# Altium schematic sheet mainboard.SchDoc
size A; SheetNumber: 1; SheetTotal: 8
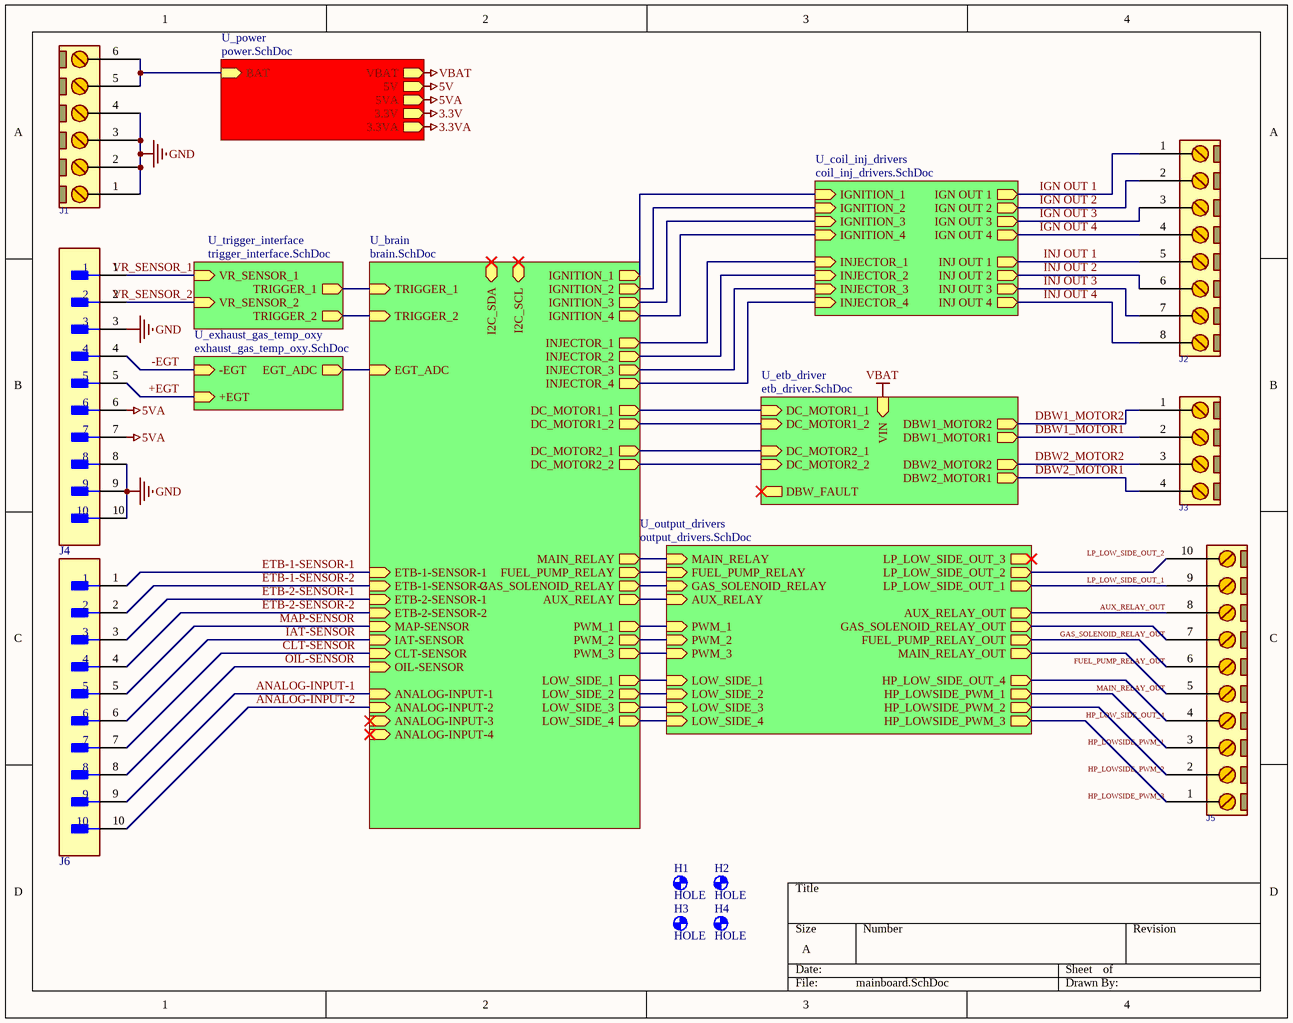
[diagram p0: mainboard.SchDoc]

## Parts
H1  HOLE  [P3.2]  (no BOM)
H2  HOLE  [P3.2]  (no BOM)
H3  HOLE  [P3.2]  (no BOM)
H4  HOLE  [P3.2]  (no BOM)
J1  CONN_TB6  [MSTB_6]  (value not drawn)
J2  CONN_TB8  [MSTB_8]  (value not drawn)
J3  CONN_TB4  [MSTB_4]  (value not drawn)
J4  PHOENIX MINI 10P  [CON_PHOENIX_MINI_10]  (value not drawn)
J5  CONN_TB10  [MSTB_10]  (value not drawn)
J6  PHOENIX MINI 10P  [CON_PHOENIX_MINI_10]  (value not drawn)

## Sub-sheets
U_brain = brain.SchDoc: LOW_SIDE_1 (out), INJECTOR_3 (out), INJECTOR_2 (out), INJECTOR_1 (out), I2C_SCL (bidir), I2C_SDA (bidir), TRIGGER_1 (in), MAIN_RELAY (out), FUEL_PUMP_RELAY (out), AUX_RELAY (out), DC_MOTOR1_2 (out), DC_MOTOR1_1 (out), IGNITION_1 (out), ETB-1-SENSOR-1 (in), ETB-1-SENSOR-2 (in), ETB-2-SENSOR-1 (in), ETB-2-SENSOR-2 (in), INJECTOR_4 (out), IGNITION_2 (out), IGNITION_3 (out), IGNITION_4 (out), DC_MOTOR2_2 (out), DC_MOTOR2_1 (out), LOW_SIDE_2 (out), LOW_SIDE_3 (out), LOW_SIDE_4 (out), TRIGGER_2 (in), MAP-SENSOR (in), IAT-SENSOR (in), CLT-SENSOR (in), OIL-SENSOR (in), ANALOG-INPUT-1 (in), ANALOG-INPUT-3 (in), ANALOG-INPUT-4 (in), ANALOG-INPUT-2 (in), PWM_1 (out), PWM_2 (out), PWM_3 (out), EGT_ADC (in), GAS_SOLENOID_RELAY (out)
U_coil_inj_drivers = coil_inj_drivers.SchDoc: IGN OUT 1 (out), IGN OUT 2 (out), IGN OUT 3 (out), IGN OUT 4 (out), INJ OUT 4 (out), INJ OUT 3 (out), INJ OUT 2 (out), INJ OUT 1 (out), IGNITION_2 (in), IGNITION_3 (in), IGNITION_4 (in), INJECTOR_1 (in), INJECTOR_2 (in), INJECTOR_3 (in), INJECTOR_4 (in), IGNITION_1 (in)
U_etb_driver = etb_driver.SchDoc: VIN (in), DBW1_MOTOR1 (out), DBW1_MOTOR2 (out), DBW2_MOTOR1 (out), DBW2_MOTOR2 (out), DBW_FAULT (out), DC_MOTOR1_1 (in), DC_MOTOR1_2 (in), DC_MOTOR2_1 (in), DC_MOTOR2_2 (in)
U_exhaust_gas_temp_oxy = exhaust_gas_temp_oxy.SchDoc: -EGT (in), +EGT (in), EGT_ADC (out)
U_output_drivers = output_drivers.SchDoc: MAIN_RELAY_OUT (out), FUEL_PUMP_RELAY_OUT (out), GAS_SOLENOID_RELAY_OUT (out), AUX_RELAY (in), PWM_1 (in), PWM_2 (in), PWM_3 (in), LOW_SIDE_1 (in), LOW_SIDE_2 (in), LOW_SIDE_3 (in), LOW_SIDE_4 (in), HP_LOWSIDE_PWM_1 (out), HP_LOWSIDE_PWM_2 (out), HP_LOWSIDE_PWM_3 (out), AUX_RELAY_OUT (out), HP_LOW_SIDE_OUT_4 (out), LP_LOW_SIDE_OUT_1 (out), LP_LOW_SIDE_OUT_2 (out), LP_LOW_SIDE_OUT_3 (out), MAIN_RELAY (in), FUEL_PUMP_RELAY (in), GAS_SOLENOID_RELAY (in)
U_power = power.SchDoc: BAT (in), VBAT (out), 5V (out), 5VA (out), 3.3V (out), 3.3VA (out)
U_trigger_interface = trigger_interface.SchDoc: VR_SENSOR_1 (in), VR_SENSOR_2 (in), TRIGGER_2 (out), TRIGGER_1 (out)

## Nets
3.3V: sheet U_power/3.3V
3.3VA: sheet U_power/3.3VA
5V: sheet U_power/5V
5VA: J4.6 J4.7 ; sheet U_power/5VA
GND: J1.1 J1.2 J1.3 J1.4 J4.3 J4.8 J4.9 J4.10
VBAT: sheet U_etb_driver/VIN, sheet U_power/VBAT
+EGT: J4.5 ; sheet U_exhaust_gas_temp_oxy/+EGT
-EGT: J4.4 ; sheet U_exhaust_gas_temp_oxy/-EGT
ANALOG-INPUT-1: J6.9 ; sheet U_brain/ANALOG-INPUT-1
ANALOG-INPUT-2: J6.10 ; sheet U_brain/ANALOG-INPUT-2
AUX_RELAY_OUT: J5.8 ; sheet U_output_drivers/AUX_RELAY_OUT
CLT-SENSOR: J6.7 ; sheet U_brain/CLT-SENSOR
DBW1_MOTOR1: J3.2 ; sheet U_etb_driver/DBW1_MOTOR1
DBW1_MOTOR2: J3.1 ; sheet U_etb_driver/DBW1_MOTOR2
DBW2_MOTOR1: J3.4 ; sheet U_etb_driver/DBW2_MOTOR1
DBW2_MOTOR2: J3.3 ; sheet U_etb_driver/DBW2_MOTOR2
ETB-1-SENSOR-1: J6.1 ; sheet U_brain/ETB-1-SENSOR-1
ETB-1-SENSOR-2: J6.2 ; sheet U_brain/ETB-1-SENSOR-2
ETB-2-SENSOR-1: J6.3 ; sheet U_brain/ETB-2-SENSOR-1
ETB-2-SENSOR-2: J6.4 ; sheet U_brain/ETB-2-SENSOR-2
FUEL_PUMP_RELAY_OUT: J5.6 ; sheet U_output_drivers/FUEL_PUMP_RELAY_OUT
GAS_SOLENOID_RELAY_OUT: J5.7 ; sheet U_output_drivers/GAS_SOLENOID_RELAY_OUT
HP_LOW_SIDE_OUT_4: J5.4 ; sheet U_output_drivers/HP_LOW_SIDE_OUT_4
HP_LOWSIDE_PWM_1: J5.3 ; sheet U_output_drivers/HP_LOWSIDE_PWM_1
HP_LOWSIDE_PWM_2: J5.2 ; sheet U_output_drivers/HP_LOWSIDE_PWM_2
HP_LOWSIDE_PWM_3: J5.1 ; sheet U_output_drivers/HP_LOWSIDE_PWM_3
IAT-SENSOR: J6.6 ; sheet U_brain/IAT-SENSOR
IGN OUT 1: J2.1 ; sheet U_coil_inj_drivers/IGN OUT 1
IGN OUT 2: J2.2 ; sheet U_coil_inj_drivers/IGN OUT 2
IGN OUT 3: J2.3 ; sheet U_coil_inj_drivers/IGN OUT 3
IGN OUT 4: J2.4 ; sheet U_coil_inj_drivers/IGN OUT 4
INJ OUT 1: J2.5 ; sheet U_coil_inj_drivers/INJ OUT 1
INJ OUT 2: J2.6 ; sheet U_coil_inj_drivers/INJ OUT 2
INJ OUT 3: J2.7 ; sheet U_coil_inj_drivers/INJ OUT 3
INJ OUT 4: J2.8 ; sheet U_coil_inj_drivers/INJ OUT 4
LP_LOW_SIDE_OUT_1: J5.9 ; sheet U_output_drivers/LP_LOW_SIDE_OUT_1
LP_LOW_SIDE_OUT_2: J5.10 ; sheet U_output_drivers/LP_LOW_SIDE_OUT_2
MAIN_RELAY_OUT: J5.5 ; sheet U_output_drivers/MAIN_RELAY_OUT
MAP-SENSOR: J6.5 ; sheet U_brain/MAP-SENSOR
OIL-SENSOR: J6.8 ; sheet U_brain/OIL-SENSOR
VR_SENSOR_1: J4.1 ; sheet U_trigger_interface/VR_SENSOR_1
VR_SENSOR_2: J4.2 ; sheet U_trigger_interface/VR_SENSOR_2
NetJ1_5: J1.5 J1.6 ; sheet U_power/BAT
(unnamed): sheet U_etb_driver/DC_MOTOR1_1, sheet U_brain/DC_MOTOR1_1
(unnamed): sheet U_etb_driver/DC_MOTOR1_2, sheet U_brain/DC_MOTOR1_2
(unnamed): sheet U_etb_driver/DC_MOTOR2_1, sheet U_brain/DC_MOTOR2_1
(unnamed): sheet U_etb_driver/DC_MOTOR2_2, sheet U_brain/DC_MOTOR2_2
(unnamed): sheet U_coil_inj_drivers/IGNITION_2, sheet U_brain/IGNITION_2
(unnamed): sheet U_coil_inj_drivers/IGNITION_3, sheet U_brain/IGNITION_3
(unnamed): sheet U_coil_inj_drivers/IGNITION_4, sheet U_brain/IGNITION_4
(unnamed): sheet U_coil_inj_drivers/INJECTOR_1, sheet U_brain/INJECTOR_1
(unnamed): sheet U_coil_inj_drivers/INJECTOR_2, sheet U_brain/INJECTOR_2
(unnamed): sheet U_coil_inj_drivers/INJECTOR_3, sheet U_brain/INJECTOR_3
(unnamed): sheet U_coil_inj_drivers/INJECTOR_4, sheet U_brain/INJECTOR_4
(unnamed): sheet U_coil_inj_drivers/IGNITION_1, sheet U_brain/IGNITION_1
(unnamed): sheet U_brain/LOW_SIDE_1, sheet U_output_drivers/LOW_SIDE_1
(unnamed): sheet U_brain/TRIGGER_1, sheet U_trigger_interface/TRIGGER_1
(unnamed): sheet U_brain/MAIN_RELAY, sheet U_output_drivers/MAIN_RELAY
(unnamed): sheet U_brain/FUEL_PUMP_RELAY, sheet U_output_drivers/FUEL_PUMP_RELAY
(unnamed): sheet U_brain/AUX_RELAY, sheet U_output_drivers/AUX_RELAY
(unnamed): sheet U_brain/LOW_SIDE_2, sheet U_output_drivers/LOW_SIDE_2
(unnamed): sheet U_brain/LOW_SIDE_3, sheet U_output_drivers/LOW_SIDE_3
(unnamed): sheet U_brain/LOW_SIDE_4, sheet U_output_drivers/LOW_SIDE_4
(unnamed): sheet U_brain/TRIGGER_2, sheet U_trigger_interface/TRIGGER_2
(unnamed): sheet U_brain/PWM_1, sheet U_output_drivers/PWM_1
(unnamed): sheet U_brain/PWM_2, sheet U_output_drivers/PWM_2
(unnamed): sheet U_brain/PWM_3, sheet U_output_drivers/PWM_3
(unnamed): sheet U_brain/EGT_ADC, sheet U_exhaust_gas_temp_oxy/EGT_ADC
(unnamed): sheet U_brain/GAS_SOLENOID_RELAY, sheet U_output_drivers/GAS_SOLENOID_RELAY

## Library data of the parts
H1-H4 = MOUNT-HOLE: MOUNTING HOLE with drill center marker
J1 = CONN_MSTB_6: CONN, PHOENIX MSTB, 5-G, 5.08mm pitch; PARAM2: 320V; PARAM: 12A; VALUE: CONN_TB6
J2 = CONN_MSTB_8: CONN, PHOENIX MSTB, 5-G, 5.08mm pitch; PARAM2: 320V; PARAM: 12A; VALUE: CONN_TB8
J3 = CONN_MSTB_4: CONN, PHOENIX MSTB, 5-G, 5.08mm pitch; PARAM2: 320V; PARAM: 12A; VALUE: CONN_TB4
J4 J6 = PHOENIX MINI 10P: 1803358 Header; 8 A; 160 V; 3.81; 10; Soldering; 1.2 mm; 2.5 kV; 160/250 V; PBT; NexarPartId: 71670; Number of Positions Per Level: 10; Voltage Rating: 160V; Current: 8A; Number of Levels: 1; Connector Type: Plug; Approvals: CSA, UL; Voltage Rating (DC): 640mV; Gender: Male; Voltage: 300V; Test Voltage: 2.5kV; Pitch: 3.81mm; Housing Material: Polybutylene; Depth: 9.2mm; Max Current Rating: 8A; Voltage Rating (AC): 160V; Contact Material: Tin; Termination: Solder; Lead Pitch: 3.81mm; Current Rating: 8A; Mount: Through Hole; Flammability Rating: UL94 V-0; Number of Rows: 1; Lead Free: Lead Free; RoHS: Compliant; Length: 39.49mm; Weight: 113.398093g; Housing Color: Green; Number of Contacts: 10; Contact Gender: Male; Number of Positions: 10; Height: 7.4mm; Orientation: Right Angle; Color: Green; Contact Plating: Tin; Number of Poles: 10; Width: 39.49mm
J5 = CONN_MSTB_10: CONN, PHOENIX MSTB, 5-G, 5.08mm pitch; PARAM2: 320V; PARAM: 12A; VALUE: CONN_TB10